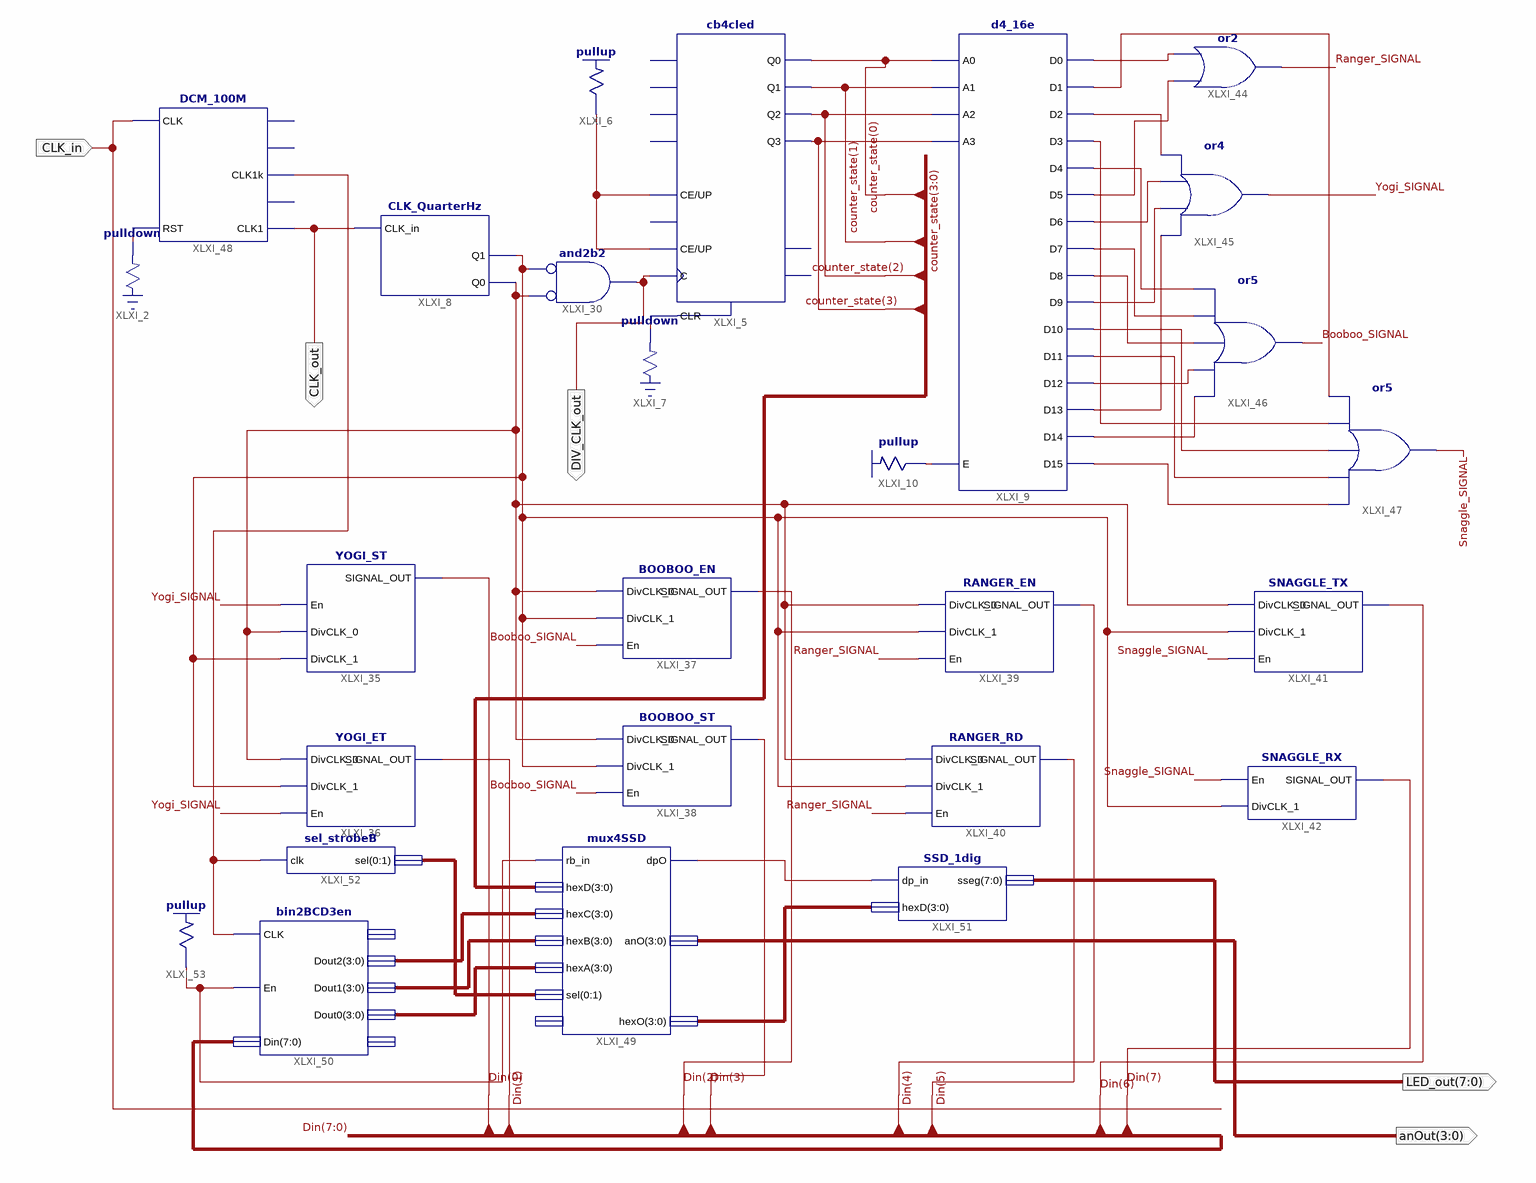
[diagram p0: schematic sheet 1]
// Xilinx ISE schematic basic_machine.sch (spartan3e) as structural Verilog: 26 symbols, 5 ports
module basic_machine (
  input  CLK_in,
  output [3:0] anOut,
  output CLK_out,
  output DIV_CLK_out,
  output [7:0] LED_out
);

  wire Booboo_SIGNAL, Ranger_SIGNAL, Snaggle_SIGNAL, XLXN_6, XLXN_7, XLXN_16, XLXN_27, XLXN_54, XLXN_96,
       XLXN_97, XLXN_102, XLXN_103, XLXN_104, XLXN_105, XLXN_118, XLXN_119, XLXN_120, XLXN_121, XLXN_122,
       XLXN_123, XLXN_124, XLXN_125, XLXN_126, XLXN_127, XLXN_154, XLXN_157, XLXN_161, XLXN_163, Yogi_SIGNAL;
  wire [1:0] XLXN_160;
  wire [3:0] counter_state, XLXN_150, XLXN_151, XLXN_152, XLXN_156;
  wire [7:0] Din;

  \pulldown  XLXI_2 (.O(XLXN_161));
  cb4cled XLXI_5 (
    .C(DIV_CLK_out), .CE(XLXN_6), .CLR(XLXN_7), .UP(XLXN_6), .Q0(counter_state[0]), .Q1(counter_state[1]),
    .Q2(counter_state[2]), .Q3(counter_state[3]));  // open: D0, D1, D2, D3, L, CEO, TC
  \pullup  XLXI_6 (.O(XLXN_6));
  \pulldown  XLXI_7 (.O(XLXN_7));
  CLK_QuarterHz XLXI_8 (.CLK_in(CLK_out), .Q1(XLXN_54), .Q0(XLXN_27));
  d4_16e XLXI_9 (
    .A0(counter_state[0]), .A1(counter_state[1]), .A2(counter_state[2]), .A3(counter_state[3]), .E(XLXN_16),
    .D0(XLXN_96), .D1(XLXN_127), .D10(XLXN_125), .D11(XLXN_124), .D12(XLXN_121), .D13(XLXN_105),
    .D14(XLXN_122), .D15(XLXN_123), .D2(XLXN_102), .D3(XLXN_126), .D4(XLXN_118), .D5(XLXN_97), .D6(XLXN_103),
    .D7(XLXN_119), .D8(XLXN_120), .D9(XLXN_104));
  \pullup  XLXI_10 (.O(XLXN_16));
  YOGI_ST XLXI_35 (.DivCLK_0(XLXN_27), .DivCLK_1(XLXN_54), .En(Yogi_SIGNAL), .SIGNAL_OUT(Din[0]));
  YOGI_ET XLXI_36 (.DivCLK_0(XLXN_27), .DivCLK_1(XLXN_54), .En(Yogi_SIGNAL), .SIGNAL_OUT(Din[1]));
  and XLXI_30 (DIV_CLK_out, ~XLXN_54, ~XLXN_27);  // and2b2
  BOOBOO_EN XLXI_37 (.DivCLK_0(XLXN_27), .DivCLK_1(XLXN_54), .En(Booboo_SIGNAL), .SIGNAL_OUT(Din[2]));
  BOOBOO_ST XLXI_38 (.DivCLK_0(XLXN_27), .DivCLK_1(XLXN_54), .En(Booboo_SIGNAL), .SIGNAL_OUT(Din[3]));
  RANGER_EN XLXI_39 (.DivCLK_0(XLXN_27), .DivCLK_1(XLXN_54), .En(Ranger_SIGNAL), .SIGNAL_OUT(Din[4]));
  RANGER_RD XLXI_40 (.DivCLK_0(XLXN_27), .DivCLK_1(XLXN_54), .En(Ranger_SIGNAL), .SIGNAL_OUT(Din[5]));
  SNAGGLE_TX XLXI_41 (.DivCLK_0(XLXN_27), .DivCLK_1(XLXN_54), .En(Snaggle_SIGNAL), .SIGNAL_OUT(Din[6]));
  SNAGGLE_RX XLXI_42 (.En(Snaggle_SIGNAL), .DivCLK_1(XLXN_54), .SIGNAL_OUT(Din[7]));
  or XLXI_44 (Ranger_SIGNAL, XLXN_97, XLXN_96);
  or XLXI_45 (Yogi_SIGNAL, XLXN_105, XLXN_104, XLXN_103, XLXN_102);
  or XLXI_46 (Booboo_SIGNAL, XLXN_122, XLXN_121, XLXN_120, XLXN_119, XLXN_118);
  or XLXI_47 (Snaggle_SIGNAL, XLXN_123, XLXN_124, XLXN_125, XLXN_126, XLXN_127);
  DCM_100M XLXI_48 (.CLK(CLK_in), .RST(XLXN_161), .CLK1k(XLXN_154), .CLK1(CLK_out));  // open: CLK1M, CLK10k, CLK100
  mux4SSD XLXI_49 (
    .rb_in(XLXN_163), .hexD(counter_state), .hexC(XLXN_150), .hexB(XLXN_151), .hexA(XLXN_152),
    .sel({XLXN_160[0], XLXN_160[1]}), .dpO(XLXN_157), .anO(anOut), .hexO(XLXN_156));  // open: dp_in
  bin2BCD3en XLXI_50 (
    .CLK(XLXN_154), .En(XLXN_163), .Din(Din), .Dout2(XLXN_150), .Dout1(XLXN_151), .Dout0(XLXN_152));  // open: Dout3, RBout
  SSD_1dig XLXI_51 (.dp_in(XLXN_157), .hexD(XLXN_156), .sseg(LED_out));
  sel_strobeB XLXI_52 (.clk(XLXN_154), .sel({XLXN_160[0], XLXN_160[1]}));
  \pullup  XLXI_53 (.O(XLXN_163));
endmodule
